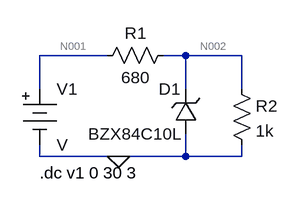
[diagram p0: schematic prac-2 Zener.asc]
prac-2 Zener.asc, the LTspice schematic file:
Version 4
SHEET 1 880 680
WIRE 128 64 32 64
WIRE 240 64 208 64
WIRE 320 64 240 64
WIRE 32 112 32 64
WIRE 240 112 240 64
WIRE 320 112 320 64
WIRE 32 208 32 192
WIRE 144 208 32 208
WIRE 240 208 240 176
WIRE 240 208 144 208
WIRE 320 208 320 192
WIRE 320 208 240 208
FLAG 144 208 0
SYMBOL Misc\\battery 32 96 R0
SYMATTR InstName V1
SYMBOL res 224 48 R90
WINDOW 0 0 56 VBottom 2
WINDOW 3 32 56 VTop 2
SYMATTR InstName R1
SYMATTR Value 680
SYMBOL res 304 96 R0
SYMATTR InstName R2
SYMATTR Value 1k
SYMBOL zener 256 176 R180
WINDOW 0 24 64 Left 2
WINDOW 3 24 0 Left 2
SYMATTR InstName D1
SYMATTR Value BZX84C10L
TEXT 32 232 Left 2 !.dc v1 0 30 3

The netlist it stands for:
* prac-2 Zener.asc
V1 N001 0 V
R1 N002 N001 680
R2 N002 0 1k
D1 0 N002 BZX84C10L
.model D D
.lib standard.dio
.dc v1 0 30 3
.backanno
.end

* Results of the author's LTspice run, read from the files saved beside the schematic
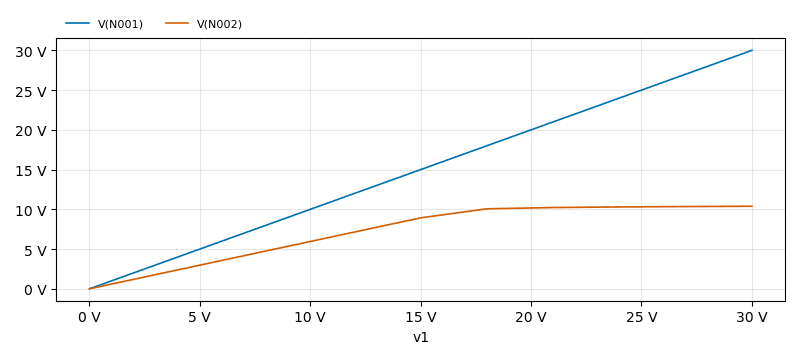
[diagram p1: DC transfer characteristic of prac-2 Zener.asc, plotted from the saved traces]
* DC transfer characteristic, 1 run:
*   V(N001): 0 V at v1=0 V, 30 V at v1=30 V, min 0 V, max 30 V
*   V(N002): 0 V at v1=0 V, 10.39 V at v1=30 V, min 0 V, max 10.39 V